# Altium schematic sheet Power.SchDoc
size 420 x 297 mm; Address1: Address1; Address2: Address2; Address3: Address3; Address4: Address4; DocumentNumber: АБВГ.123456.001 Э3; SheetNumber: 1; Scale: 1:1; DocumentType: Схема электрическая принципиальная; FirstReferrence: АБВГ.123456.001
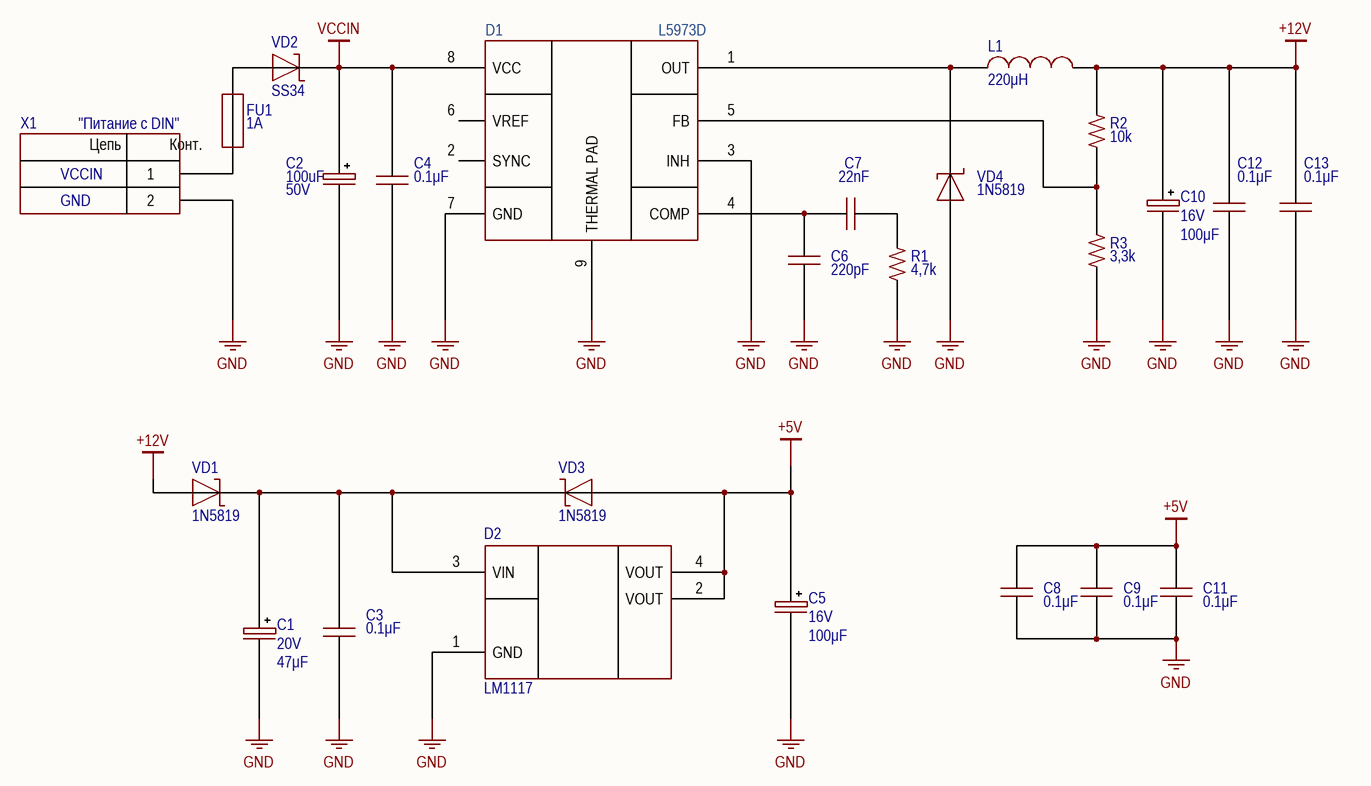
[diagram p0: Power.SchDoc]

## Parts
C1  Напряжение: 20V  Значение: 47μF  [CAP: TANTAL-D]
C2  value 100uF  Voltage: 50V  [CAP: SMD D8A6.9]
C3  value 0.1μF  [CAP: 0805]
C4  value 0.1μF  [CAP: 0805]
C5  Напряжение: 16V  Значение: 100μF  [CAP: TANTAL-D]
C6  value 220pF  [CAP: 0805]
C7  value 22nF  [CAP: 0805]
C8  value 0.1μF  [CAP: 0805]
C9  value 0.1μF  [CAP: 0805]
C10  Напряжение: 16V  Значение: 100μF  [CAP: TANTAL-D]
C11  value 0.1μF  [CAP: 0805]
C12  value 0.1μF  [CAP: 0805]
C13  value 0.1μF  [CAP: 0805]
D1  L5973D  [HSOIC-DDA-8]
D2  (no value)  [SOT223]
FU1  MaxCurrent: 1A  [FUSE: 1812]
L1  value 220μH  [IND: CD54]
R1  value 4,7k  [RES: 0805]
R2  value 10k  [RES: 0805]
R3  value 3,3k  [RES: 0805]
VD1  PartNumber: 1N5819  [DIODE: SOD123]
VD2  PartNumber: SS34  [DIODE: SMA]
VD3  PartNumber: 1N5819  [DIODE: SOD123]
VD4  PartNumber: 1N5819  [DIODE: SOD123]
X1  CommentText: "Питание с DIN"  [CON: 15EDGVC-3.5-02 (or 691321100002)]

## Nets
+5V: C5.1 C8.2 C9.2 C11.2 D2.2(VOUT) D2.4(VOUT) VD3.1
+12V: C10.1 C12.2 C13.2 L1.1 R2.1 VD1.1
GND: C1.2 C2.2 C3.1 C4.1 C5.2 C6.2 C8.1 C9.1 C10.2 C11.1 C12.1 C13.1 D1.3(INH) D1.7(GND) D1.9(THERMAL_PAD) D2.1(GND) R1.2 R3.2 VD4.1 X1.2
VCCIN: C2.1 C4.2 D1.8(VCC) VD2.2
NetC1_1: C1.1 C3.2 D2.3(VIN) VD1.2 VD3.2
NetC6_1: C6.1 C7.2 D1.4(COMP)
NetC7_1: C7.1 R1.1
NetD1_1: D1.1(OUT) L1.2 VD4.2
NetD1_5: D1.5(FB) R2.2 R3.1
NetFU1_1: FU1.1 X1.1
NetFU1_2: FU1.2 VD2.1

Not connected (* = marked no-connect by the designer): D1 2(SYNC) 6(VREF)

## Notes on the sheet
- GND
- VCCIN
- Перв. примен.
- Справ. №
- Подп. и дата
- Инв. № дубл.
- Взам. инв. №
- Разраб.
- Изм.
- Лист
- № докум.
- Подп.
- Дата
- Лит.
- Масса
- Масштаб
- Пров.
- Т.контр.
- Листов
- Инв. № подл.
- Утв.
- Н.контр.
- 2.106-A3
- Копировал
- Формат А3
- (in symbol Connector_terminal_2pin) Цепь; Конт.

## Library data of the parts
C1 C5 C10 = Танталы SMD: Производитель: AVX; УникальныйНомер: F930J107KAAAJ6; Типоразмер: Тип А (3216); Ссылка: ***; Точность: ±10%; ТипКомпонента: Tantalum capacitor
C2 = Aluminium: Manufacturer: Capxon International Elec; PartNumber: TH102M025I200ECAB; TypeCapacitor: Конденсатор электролитический алюминиевый SMD; Package: 13x20mm
C3 C8 C9 C11-C13 = Ceramic_0805: Manufacturer: Murata Electronics; PartNumber: GRM21BR71H104KA01L; ValueManufacturerPartNumber: Керамический конденсатор, 0.1μF, X7R, ±10%, 16V, 0805, -55...+125°C; TypeCapacitor: Керамический конденсатор; Tolerance: ±10%; TypeDielectric: X7R; Voltage: 16V; Package: 0805; HelpURL: https://www.digikey.com/product-detail/en/yageo/CC0805KRX7R7BB104/311-1142-1-ND/303052; Temperature: -55...+125°C
C4 = Ceramic_0805: Manufacturer: Murata Electronics; PartNumber: GRM21BR71H104KA01L; ValueManufacturerPartNumber: Керамический конденсатор, 0.1μF, X7R, ±10%, 50V, 0805, -55...+125°C; TypeCapacitor: Керамический конденсатор; Tolerance: ±10%; TypeDielectric: X7R; Voltage: 50V; Package: 0805; HelpURL: https://www.digikey.com/product-detail/en/yageo/CC0805KRX7R7BB104/311-1142-1-ND/303052; Temperature: -55...+125°C
C6 = Ceramic_0805: Manufacturer: Murata Electronics; PartNumber: GCJ21BR71H224KA01L; ValueManufacturerPartNumber: Керамический конденсатор, 220pF, X7R, ±10%, 16V, 0805, -55...+125°C; TypeCapacitor: Керамический конденсатор; Tolerance: ±10%; TypeDielectric: X7R; Voltage: 16V; Package: 0805; HelpURL: https://www.digikey.com/product-detail/en/yageo/CC0805KRX7R7BB104/311-1142-1-ND/303052; Temperature: -55...+125°C
C7 = Ceramic_0805: Manufacturer: Murata Electronics; PartNumber: GCM216R71H223KA37D; ValueManufacturerPartNumber: Керамический конденсатор, 22nF, X7R, ±10%, 16V, 0805, -55...+125°C; TypeCapacitor: Керамический конденсатор; Tolerance: ±10%; TypeDielectric: X7R; Voltage: 16V; Package: 0805; HelpURL: https://www.digikey.com/product-detail/en/yageo/CC0805KRX7R7BB104/311-1142-1-ND/303052; Temperature: -55...+125°C
D1 = L5973D: Импульсный понижающий регулятор напряжения; Manufacturer: STMicroelectronics; ValueManufacturerPartNumber: Импульсный понижающий регулятор напряжения, supply 10...30V, 500kHz, External switch, -40...+105°C, HSOP-8; PartNumber: L5973D013TR; VoltageInput: supply 10...30V; Frequency: 500kHz; OutputType: External switch; HelpURL: https://www.digikey.com/product-detail/en/on-semiconductor/UC3842BVD1R2G/UC3842BVD1R2GOSCT-ND/5802572; Package: HSOP-8; ComponentType: Импульсный понижающий регулятор напряжения; Temperature: -40...+105°C
D2 = LM1117: Линейный регулятор с низким падением напряжения; Manufacturer: STMicroelectronics; ValueManufacturerPartNumber: Линейный регулятор с низким падением напряжения, input 3.9...18V, 0.6V, output 3.3V, 1.2A, -40...+85°C, SOT223; VoltageInput: input 3.9...18V; MaxDropout: 0.6V; CurrentOutput: 1.2A; VoltageOutput: output 3.3V; HelpURL: ***; Package: SOT223; ComponentType: Линейный регулятор с низким падением напряжения; Temperature: -40...+85°C; PartNumber: LM1117
FU1 = Fuse: Manufacturer: Littelfuse; PartNumber: 0468001.NR; TypeFuse: Предохранитель SMD; VoltageMax: 250VAC; Package: 1206; HelpURL: https://www.digikey.com/products/en?keywords=01110501Z; ValueManufacturerPartNumber: =TypeFuse+', '+VoltageMax+', '+MaxCurrent+', '+Package+', '+Temperature
L1 = Inductor_CD54: Manufacturer: YJYCOIN; PartNumber: CD54YP0504-221M; ValueManufacturerPartNumber: Fixed inductor, 220μH, ±20%, CD54, 1.44A, -40...+100°C; TypeInductor: Fixed inductor; MaxCurrent: 1.44A; Tolerance: ±20%; Package: CD54; HelpURL: https://www.digikey.com/product-detail/en/sumida-america-components-inc/CD43NP-100MC/308-1855-1-ND/3925624; Temperature: -40...+100°C
R1 = Resistor_0805_ieee: Manufacturer: Vishay Intertech; PartNumber: CRCW08054K70JNEA; ValueManufacturerPartNumber: Резистор SMD, 4,7k, ±1%, 0805, 0.125W, -55...+125°C; TypeResistor: Резистор SMD; Power: 0.125W; Tolerance: ±1%; Package: 0805; HelpURL: https://www.digikey.com/product-detail/en/yageo/RC0805JR-07100RL/311-100ARCT-ND/731185; Temperature: -55...+125°C
R2 = Resistor_0805_ieee: Manufacturer: Vishay Intertech; PartNumber: CRCW080510K0FKEA; ValueManufacturerPartNumber: Резистор SMD, 10k, ±1%, 0805, 0.125W, -55...+125°C; TypeResistor: Резистор SMD; Power: 0.125W; Tolerance: ±1%; Package: 0805; HelpURL: https://www.digikey.com/product-detail/en/yageo/RC0805JR-07100RL/311-100ARCT-ND/731185; Temperature: -55...+125°C
R3 = Resistor_0805_ieee: Manufacturer: Vishay Intertech; ValueManufacturerPartNumber: Резистор SMD, 3,3k, ±1%, 0805, 0.125W, -55...+125°C; TypeResistor: Резистор SMD; Power: 0.125W; Tolerance: ±1%; PartNumber: Vishay Intertech; Package: 0805; HelpURL: https://www.digikey.com/product-detail/en/yageo/RC0805JR-07100RL/311-100ARCT-ND/731185; Temperature: -55...+125°C
VD1-VD3 = Schottky_single: Manufacturer: BORN; ValueManufacturerPartNumber: Диод Шоттки, 80V, 500mA, 1V, 15pF, SMA, -55...+150°C; TypeDiode: Диод Шоттки; Voltage: 80V; Current: 500mA; VoltageDrop: 1V; RecoveryTime: 15pF; Package: SMA; HelpURL: https://www.digikey.com/product-detail/en/diodes-incorporated/MBR0580S1-7/MBR0580S1-7DICT-ND/5080371; Temperature: -55...+150°C
VD4 = Schottky_single: Manufacturer: Diodes Incorporated; ValueManufacturerPartNumber: Диод Шоттки, 80V, 500mA, 1V, 15pF, SOD-123, -55...+150°C; TypeDiode: Диод Шоттки; Voltage: 80V; Current: 500mA; VoltageDrop: 1V; RecoveryTime: 15pF; Package: SOD-123; HelpURL: https://www.digikey.com/product-detail/en/diodes-incorporated/MBR0580S1-7/MBR0580S1-7DICT-ND/5080371; Temperature: -55...+150°C
X1 = Connector_terminal_2pin: Manufacturer: DEGSON; ValueManufacturerPartNumber: Клеммник, 2pin, 3.5mm, 300VAC, 10A; PartNumber: DG350-3.5-02P-14-00A(H); TypeConnector: Клеммник; VoltageMax: 300VAC; Pitch: 3.5mm; CurrentMax: 10A; Multichannel: 2pin; HelpURL: https://www.chipdip.ru/product/dg350-3.5-02p-12